# EAGLE schematic Shift registers circuit (EAGLE 8.2.2)
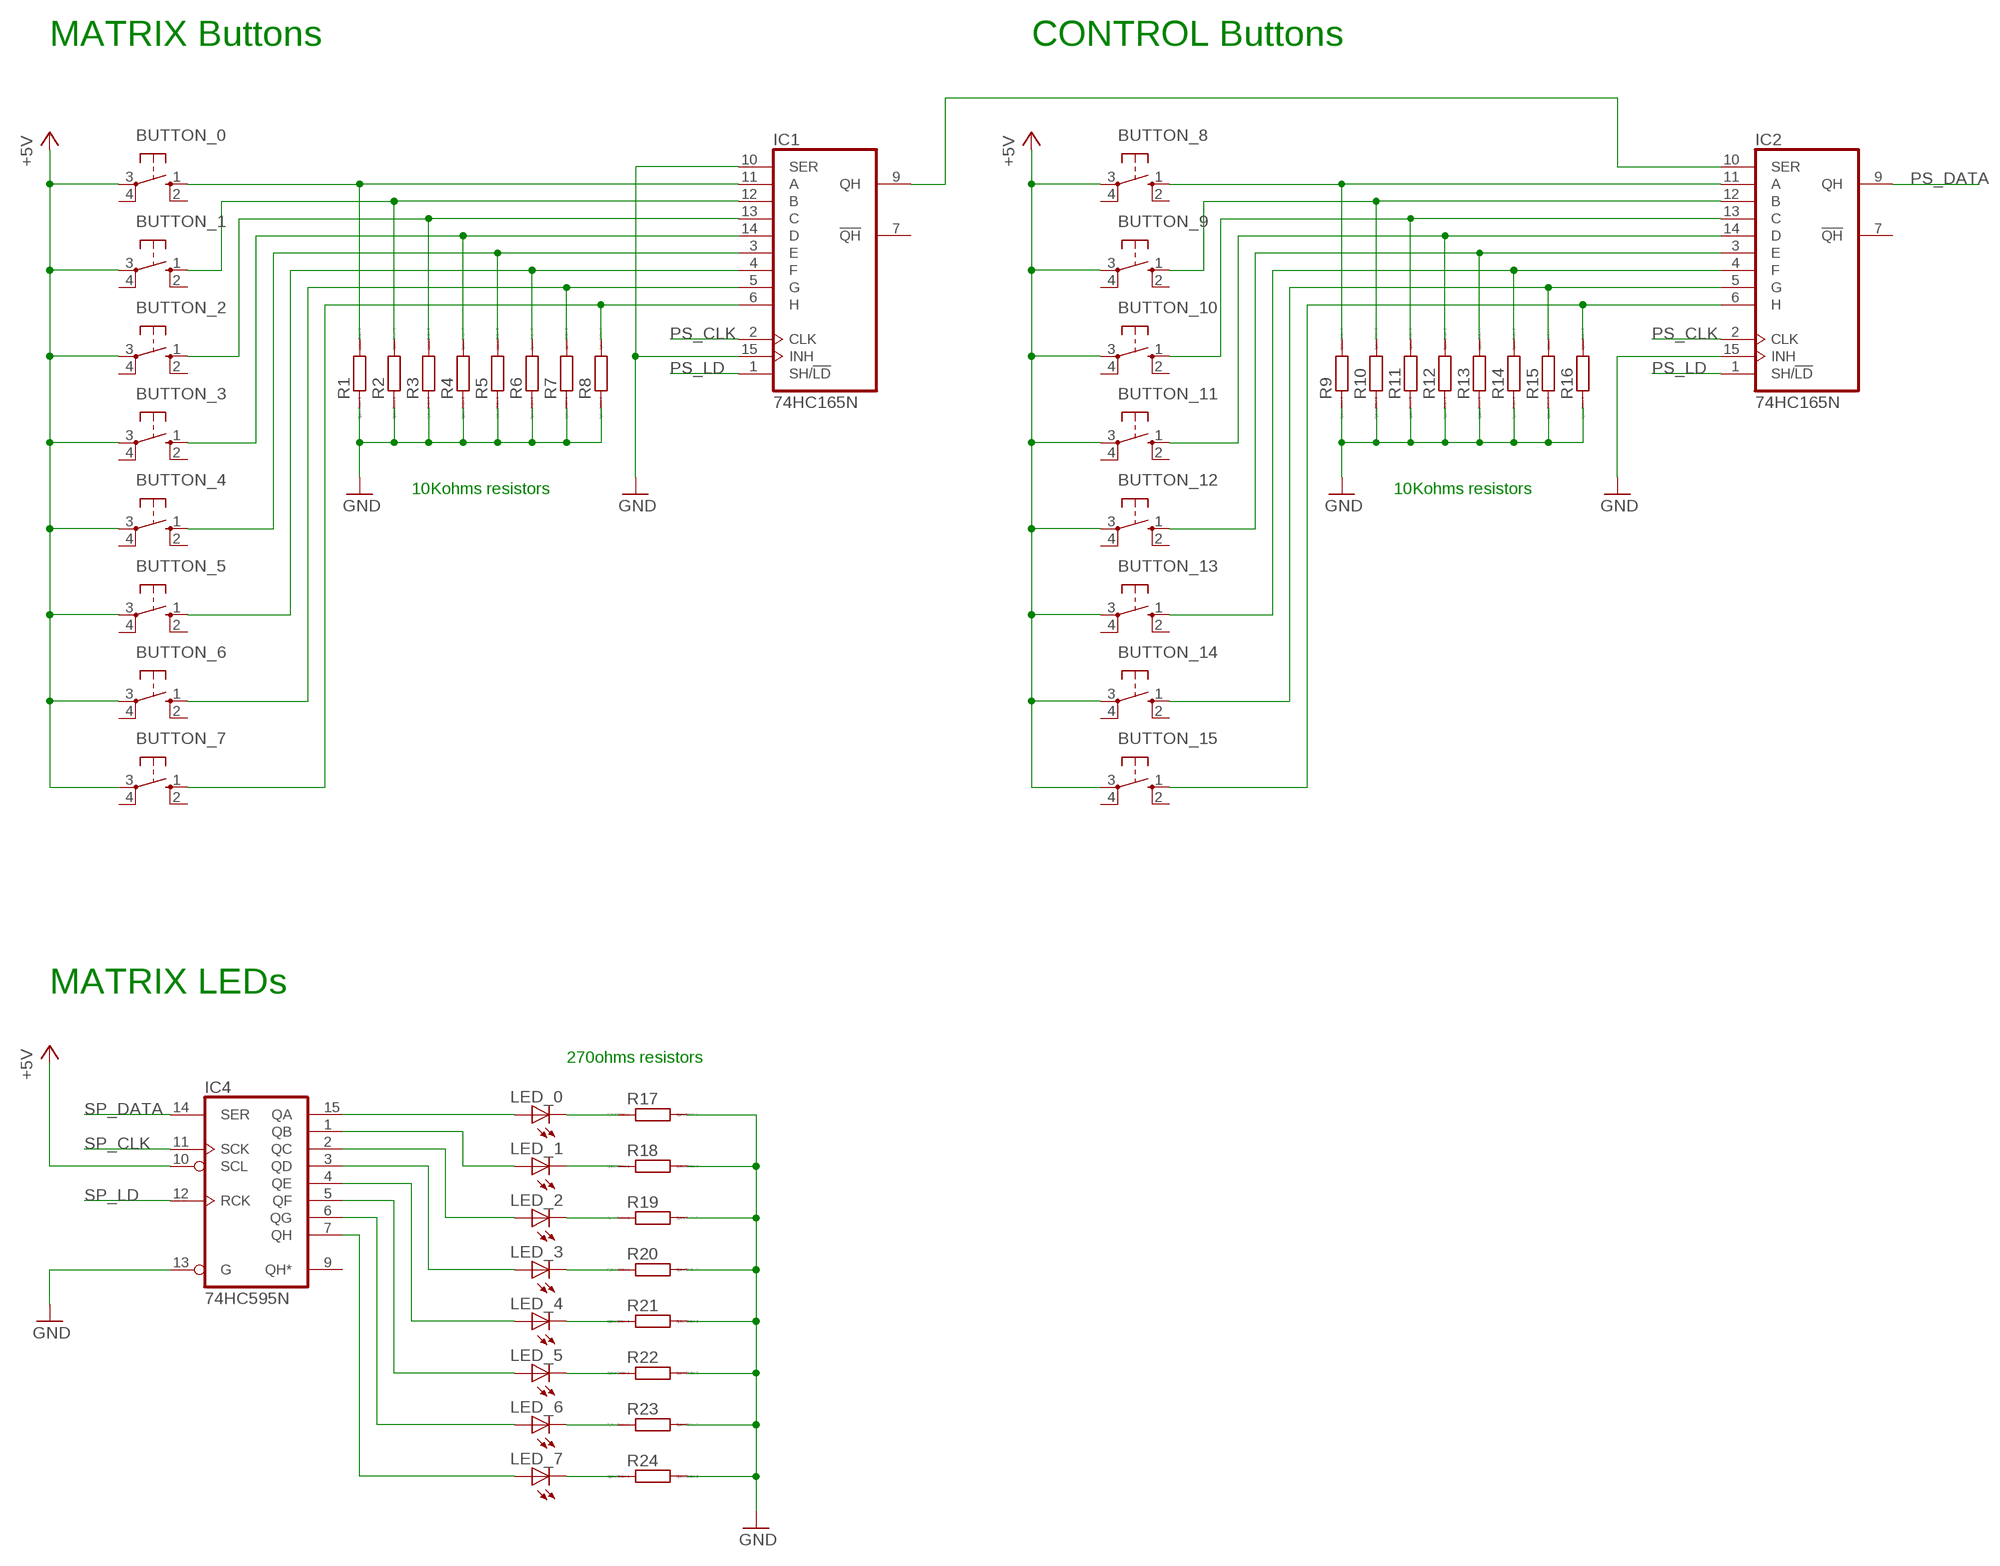
[diagram p0: schematic, sheet 1]

## Parts
BUTTON_0  10-XX  [B3F-10XX]
BUTTON_1  10-XX  [B3F-10XX]
BUTTON_2  10-XX  [B3F-10XX]
BUTTON_3  10-XX  [B3F-10XX]
BUTTON_4  10-XX  [B3F-10XX]
BUTTON_5  10-XX  [B3F-10XX]
BUTTON_6  10-XX  [B3F-10XX]
BUTTON_7  10-XX  [B3F-10XX]
BUTTON_8  10-XX  [B3F-10XX]
BUTTON_9  10-XX  [B3F-10XX]
BUTTON_10  10-XX  [B3F-10XX]
BUTTON_11  10-XX  [B3F-10XX]
BUTTON_12  10-XX  [B3F-10XX]
BUTTON_13  10-XX  [B3F-10XX]
BUTTON_14  10-XX  [B3F-10XX]
BUTTON_15  10-XX  [B3F-10XX]
IC1  74HC165N  [DIL16]
IC2  74HC165N  [DIL16]
IC4  74HC595N  [DIL16]
LED_0  LED5MM  [LED5MM]
LED_1  LED5MM  [LED5MM]
LED_2  LED5MM  [LED5MM]
LED_3  LED5MM  [LED5MM]
LED_4  LED5MM  [LED5MM]
LED_5  LED5MM  [LED5MM]
LED_6  LED5MM  [LED5MM]
LED_7  LED5MM  [LED5MM]
R1  R0207/10  [0207/10]
R2  R0207/10  [0207/10]
R3  R0207/10  [0207/10]
R4  R0207/10  [0207/10]
R5  R0207/10  [0207/10]
R6  R0207/10  [0207/10]
R7  R0207/10  [0207/10]
R8  R0207/10  [0207/10]
R9  R0207/10  [0207/10]
R10  R0207/10  [0207/10]
R11  R0207/10  [0207/10]
R12  R0207/10  [0207/10]
R13  R0207/10  [0207/10]
R14  R0207/10  [0207/10]
R15  R0207/10  [0207/10]
R16  R0207/10  [0207/10]
R17  R0207/10  [0207/10]
R18  R0207/10  [0207/10]
R19  R0207/10  [0207/10]
R20  R0207/10  [0207/10]
R21  R0207/10  [0207/10]
R22  R0207/10  [0207/10]
R23  R0207/10  [0207/10]
R24  R0207/10  [0207/10]

## Nets
+5V: BUTTON_0.3(P) BUTTON_1.3(P) BUTTON_2.3(P) BUTTON_3.3(P) BUTTON_4.3(P) BUTTON_5.3(P) BUTTON_6.3(P) BUTTON_7.3(P) BUTTON_8.3(P) BUTTON_9.3(P) BUTTON_10.3(P) BUTTON_11.3(P) BUTTON_12.3(P) BUTTON_13.3(P) BUTTON_14.3(P) BUTTON_15.3(P) IC4.10(SCL)
GND: IC1.10(SER) IC1.15(INH) IC2.15(INH) IC4.13(G) R1.1 R2.1 R3.1 R4.1 R5.1 R6.1 R7.1 R8.1 R9.1 R10.1 R11.1 R12.1 R13.1 R14.1 R15.1 R16.1 R17.2 R18.2 R19.2 R20.2 R21.2 R22.2 R23.2 R24.2
N$1: BUTTON_0.1(S) IC1.11(A) R1.2
N$2: BUTTON_1.1(S) IC1.12(B) R2.2
N$3: BUTTON_2.1(S) IC1.13(C) R3.2
N$4: BUTTON_3.1(S) IC1.14(D) R4.2
N$5: BUTTON_4.1(S) IC1.3(E) R5.2
N$6: BUTTON_5.1(S) IC1.4(F) R6.2
N$7: BUTTON_6.1(S) IC1.5(G) R7.2
N$8: BUTTON_7.1(S) IC1.6(H) R8.2
N$9: IC1.9(QH) IC2.10(SER)
N$10: LED_7.K(C) R24.1
N$11: LED_0.K(C) R17.1
N$12: LED_1.K(C) R18.1
N$13: IC4.7(QH) LED_7.A
N$14: LED_6.K(C) R23.1
N$15: IC4.6(QG) LED_6.A
N$16: BUTTON_8.1(S) IC2.11(A) R9.2
N$17: BUTTON_9.1(S) IC2.12(B) R10.2
N$18: BUTTON_10.1(S) IC2.13(C) R11.2
N$19: BUTTON_11.1(S) IC2.14(D) R12.2
N$20: BUTTON_12.1(S) IC2.3(E) R13.2
N$21: BUTTON_13.1(S) IC2.4(F) R14.2
N$22: BUTTON_14.1(S) IC2.5(G) R15.2
N$23: BUTTON_15.1(S) IC2.6(H) R16.2
N$24: IC4.5(QF) LED_5.A
N$25: IC4.4(QE) LED_4.A
N$26: IC4.3(QD) LED_3.A
N$27: IC4.2(QC) LED_2.A
N$28: LED_2.K(C) R19.1
N$29: LED_3.K(C) R20.1
N$30: LED_4.K(C) R21.1
N$31: LED_5.K(C) R22.1
N$32: IC4.1(QB) LED_1.A
N$33: IC4.15(QA) LED_0.A
PS_CLK: IC1.2(CLK) IC2.2(CLK)
PS_DATA: IC2.9(QH)
PS_LD: IC1.1(SH/!LD) IC2.1(SH/!LD)
SP_CLK: IC4.11(SCK)
SP_DATA: IC4.14(SER)
SP_LD: IC4.12(RCK)
Unconnected: BUTTON_0.2(S1) BUTTON_0.4(P1) BUTTON_1.2(S1) BUTTON_1.4(P1) BUTTON_2.2(S1) BUTTON_2.4(P1) BUTTON_3.2(S1) BUTTON_3.4(P1) BUTTON_4.2(S1) BUTTON_4.4(P1) BUTTON_5.2(S1) BUTTON_5.4(P1) BUTTON_6.2(S1) BUTTON_6.4(P1) BUTTON_7.2(S1) BUTTON_7.4(P1) BUTTON_8.2(S1) BUTTON_8.4(P1) BUTTON_9.2(S1) BUTTON_9.4(P1) BUTTON_10.2(S1) BUTTON_10.4(P1) BUTTON_11.2(S1) BUTTON_11.4(P1) BUTTON_12.2(S1) BUTTON_12.4(P1) BUTTON_13.2(S1) BUTTON_13.4(P1) BUTTON_14.2(S1) BUTTON_14.4(P1) BUTTON_15.2(S1) BUTTON_15.4(P1) IC1.7(!QH) IC2.7(!QH) IC4.9(QH*)

## Notes on the sheet
- MATRIX Buttons | CONTROL Buttons
- 10Kohms resistors | 10Kohms resistors
- MATRIX LEDs
- 270ohms resistors

## Power pins joined to a net without a drawn wire
GND: IC1.8(GND) IC2.8(GND) IC4.8(GND)
VCC: IC1.16(VCC) IC2.16(VCC) IC4.16(VCC)

## Library data of the parts
BUTTON_0 BUTTON_1-BUTTON_15 = switch-omron:10-XX: OMRON SWITCH; MPN: B3F-1000; OC_FARNELL: 176432; OC_NEWARK: 36M3542
IC1 IC2 = 74xx-eu:74*165: 8-bit parallel load SHIFT REGISTER
IC4 = 74xx-eu:74*595: 8-bit SHIFT REGISTER, output latch
LED_0 LED_1-LED_7 = led:LED: LED OSRAM: - CHIPLED LG R971, LG N971, LY N971, LG Q971, LY Q971, LO R971, LY R971 LH N974, LH R974 LS Q976, LO Q976, LY Q976 LO Q996 - Hyper CHIPLED LW Q18S LB Q993, LB Q99A, LB R99A - SideLED LS A670, LO A670, LY A670, LG A670, LP A670 LB A673, LV A673, LT A673, LW A673 LH A674 LY A675 LS A676, LA A676, LO A676, LY A676, LW A676 LS A679, LY A679, LG A679 - Hyper Micro SIDELED® LS Y876, LA Y876, LO Y876, LY Y876 LT Y87S - SmartLED LW L88C, LW L88S LB L89C, LB L89S, LG L890 LS L89K, LO L89K, LY L89K LS L896, LA L896, LO L896, LY L896 - TOPLED LS T670, LO T670, LY T670, LG T670, LP T670 LSG T670, LSP T670, LSY T670, LOP T670, LYG T670 LG T671, LOG T671, LSG T671 LB T673, LV T673, LT T673, LW T673 LH T674 LS T676, LA T676, LO T676, LY T676, LB T676, LH T676, LSB T676, LW T676 LB T67C, LV T67C, LT T67C, LS T67K, LO T67K, LY T67K, LW E67C LS E67B, LA E67B, LO E67B, LY E67B, LB E67C, LV E67C, LT E67C LW T67C LS T679, LY T679, LG T679 LS T770, LO T770, LY T770, LG T770, LP T770 LB T773, LV T773, LT T773, LW T773 LH T774 LS E675, LA E675, LY E675, LS T675 LS T776, LA T776, LO T776, LY T776, LB T776 LHGB T686 LT T68C, LB T68C - Hyper Mini TOPLED® LB M676 - Mini TOPLED Santana® LG M470 LS M47K, LO M47K, LY M47K Source: http://www.osram.convergy.de LUXEON: - LUMILED® LXK2-PW12-R00, LXK2-PW12-S00, LXK2-PW14-U00, LXK2-PW14-V00 LXK2-PM12-R00, LXK2-PM12-S00, LXK2-PM14-U00 LXK2-PE12-Q00, LXK2-PE12-R00, LXK2-PE12-S00, LXK2-PE14-T00, LXK2-PE14-U00 LXK2-PB12-K00, LXK2-PB12-L00, LXK2-PB12-M00, LXK2-PB14-N00, LXK2-PB14-P00, LXK2-PB14-Q00 LXK2-PR12-L00, LXK2-PR12-M00, LXK2-PR14-Q00, LXK2-PR14-R00 LXK2-PD12-Q00, LXK2-PD12-R00, LXK2-PD12-S00 LXK2-PH12-R00, LXK2-PH12-S00 LXK2-PL12-P00, LXK2-PL12-Q00, LXK2-PL12-R00 Source: www.luxeon.com KINGBRIGHT: KA-3528ASYC Source: www.kingbright.com
R1-R24 = eagle-ltspice:R: RESISTOR, European symbol; SPICEMODEL: NONE; SPICEPREFIX: R